# Altium schematic sheet Main.schdoc
size 508 x 338 mm
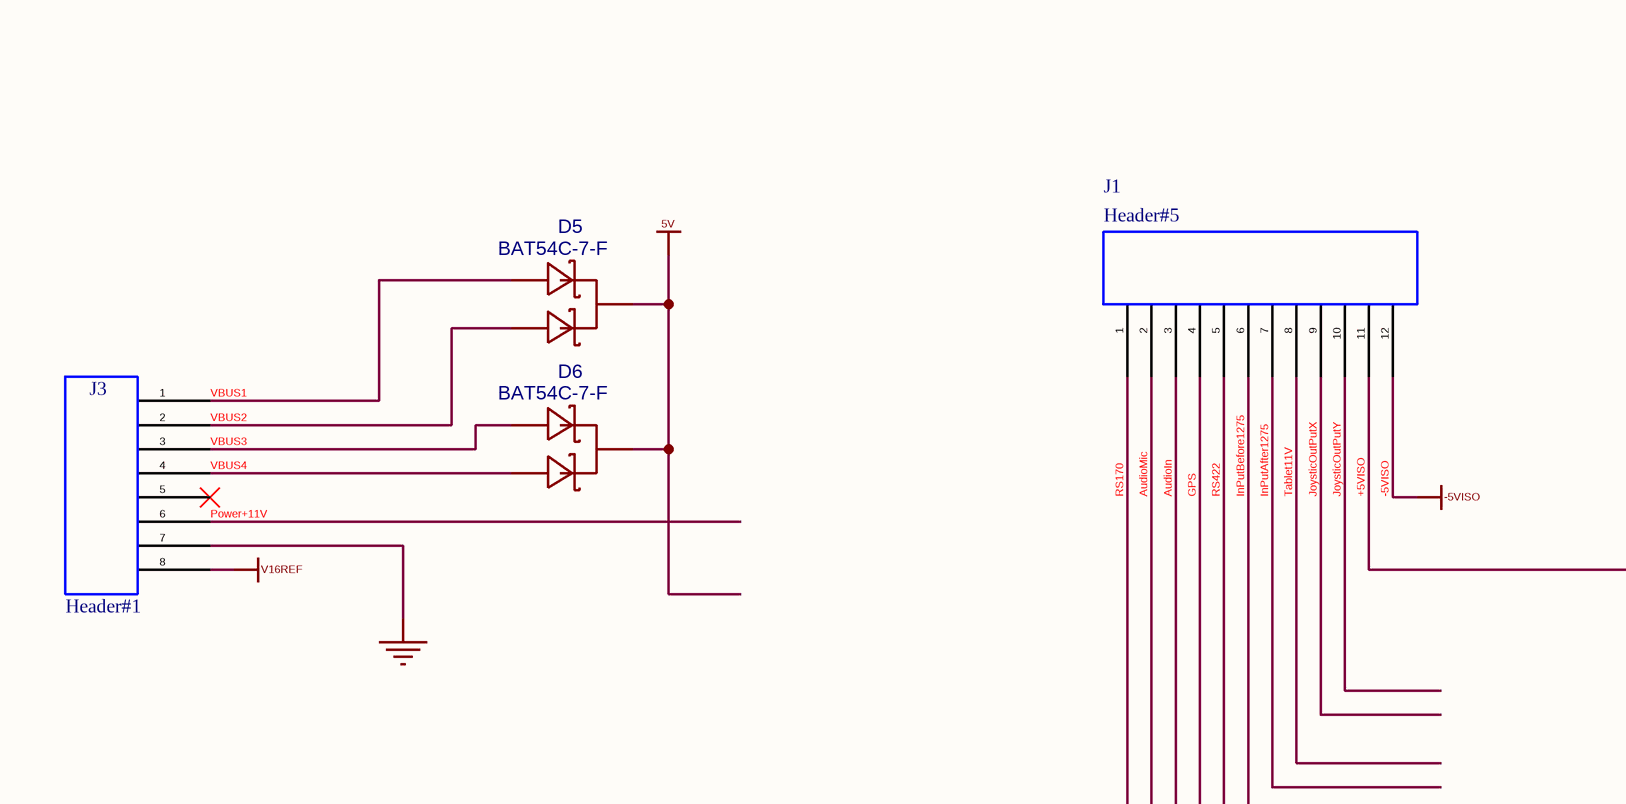
[diagram p0: Main.schdoc, top left]
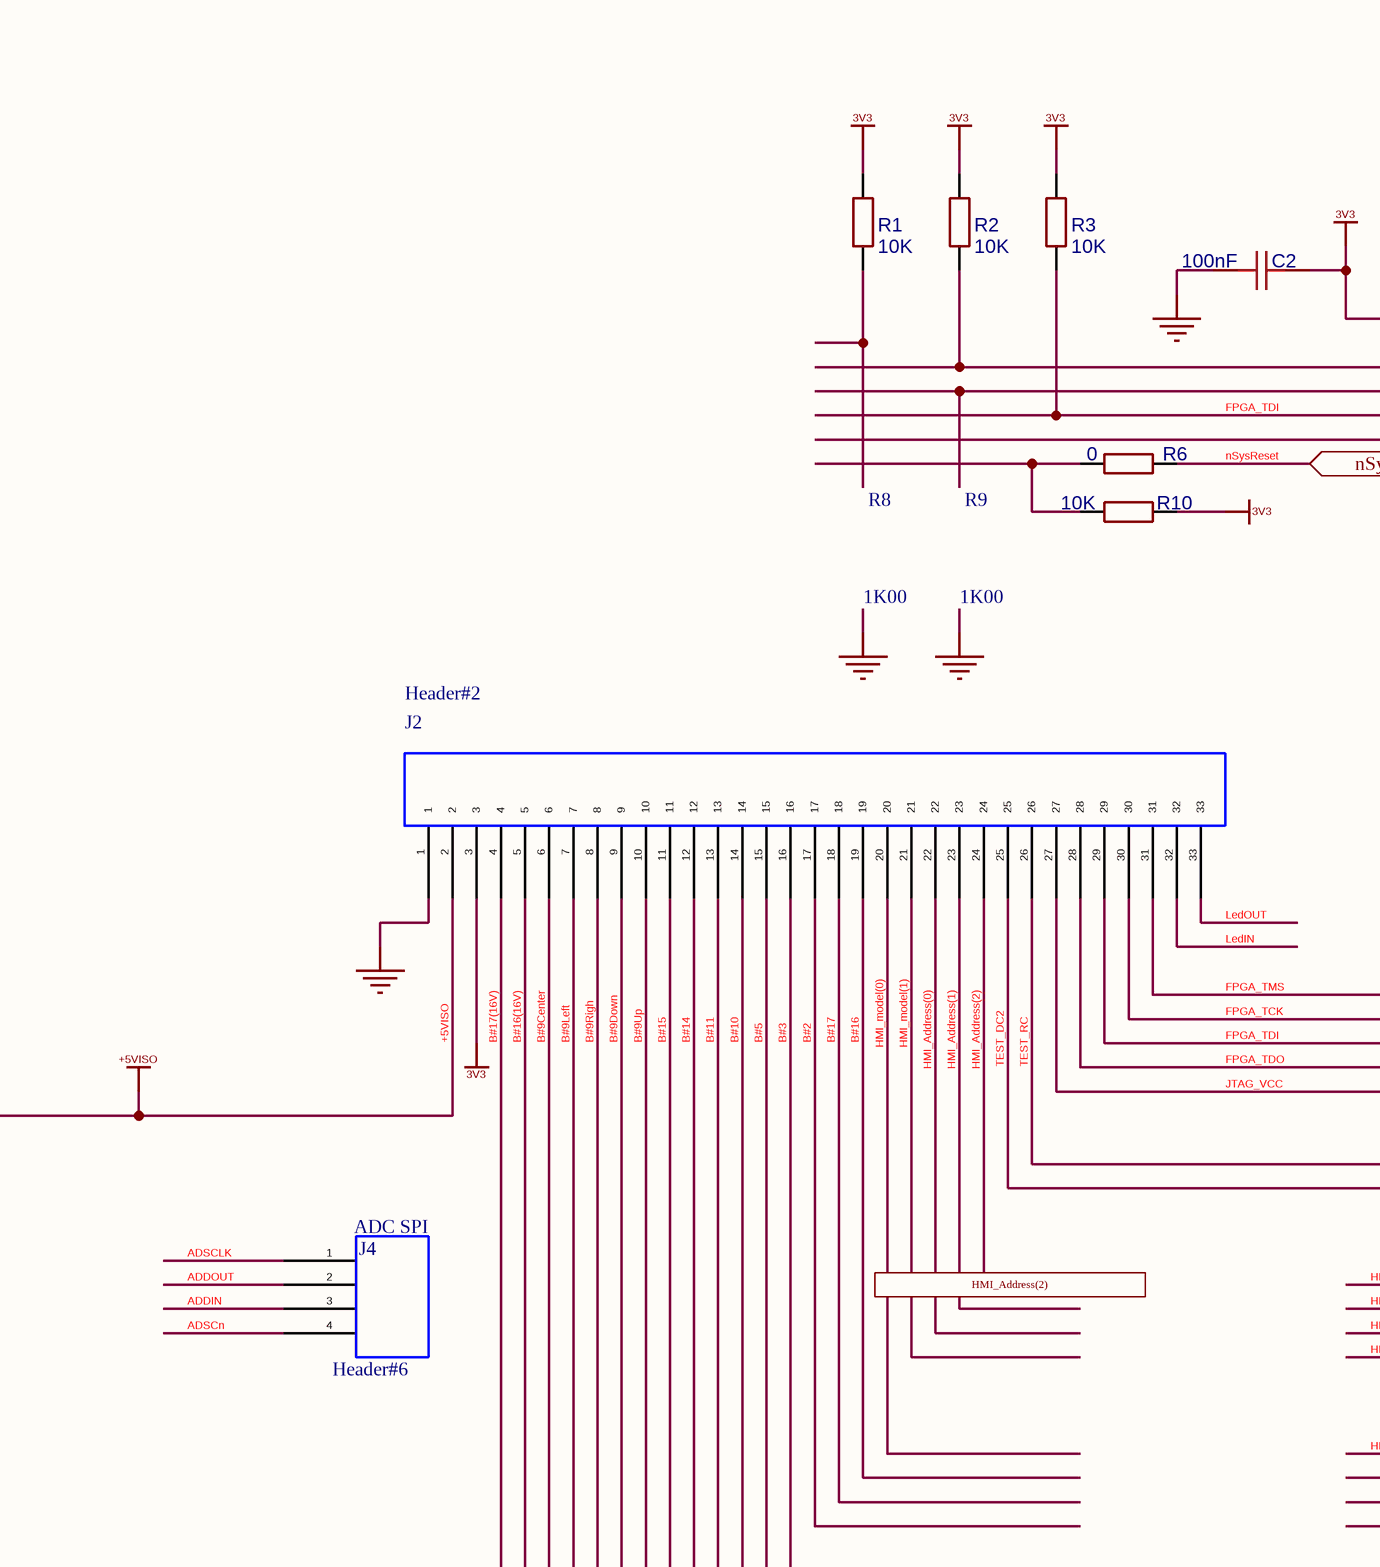
[diagram p1: Main.schdoc, top middle]
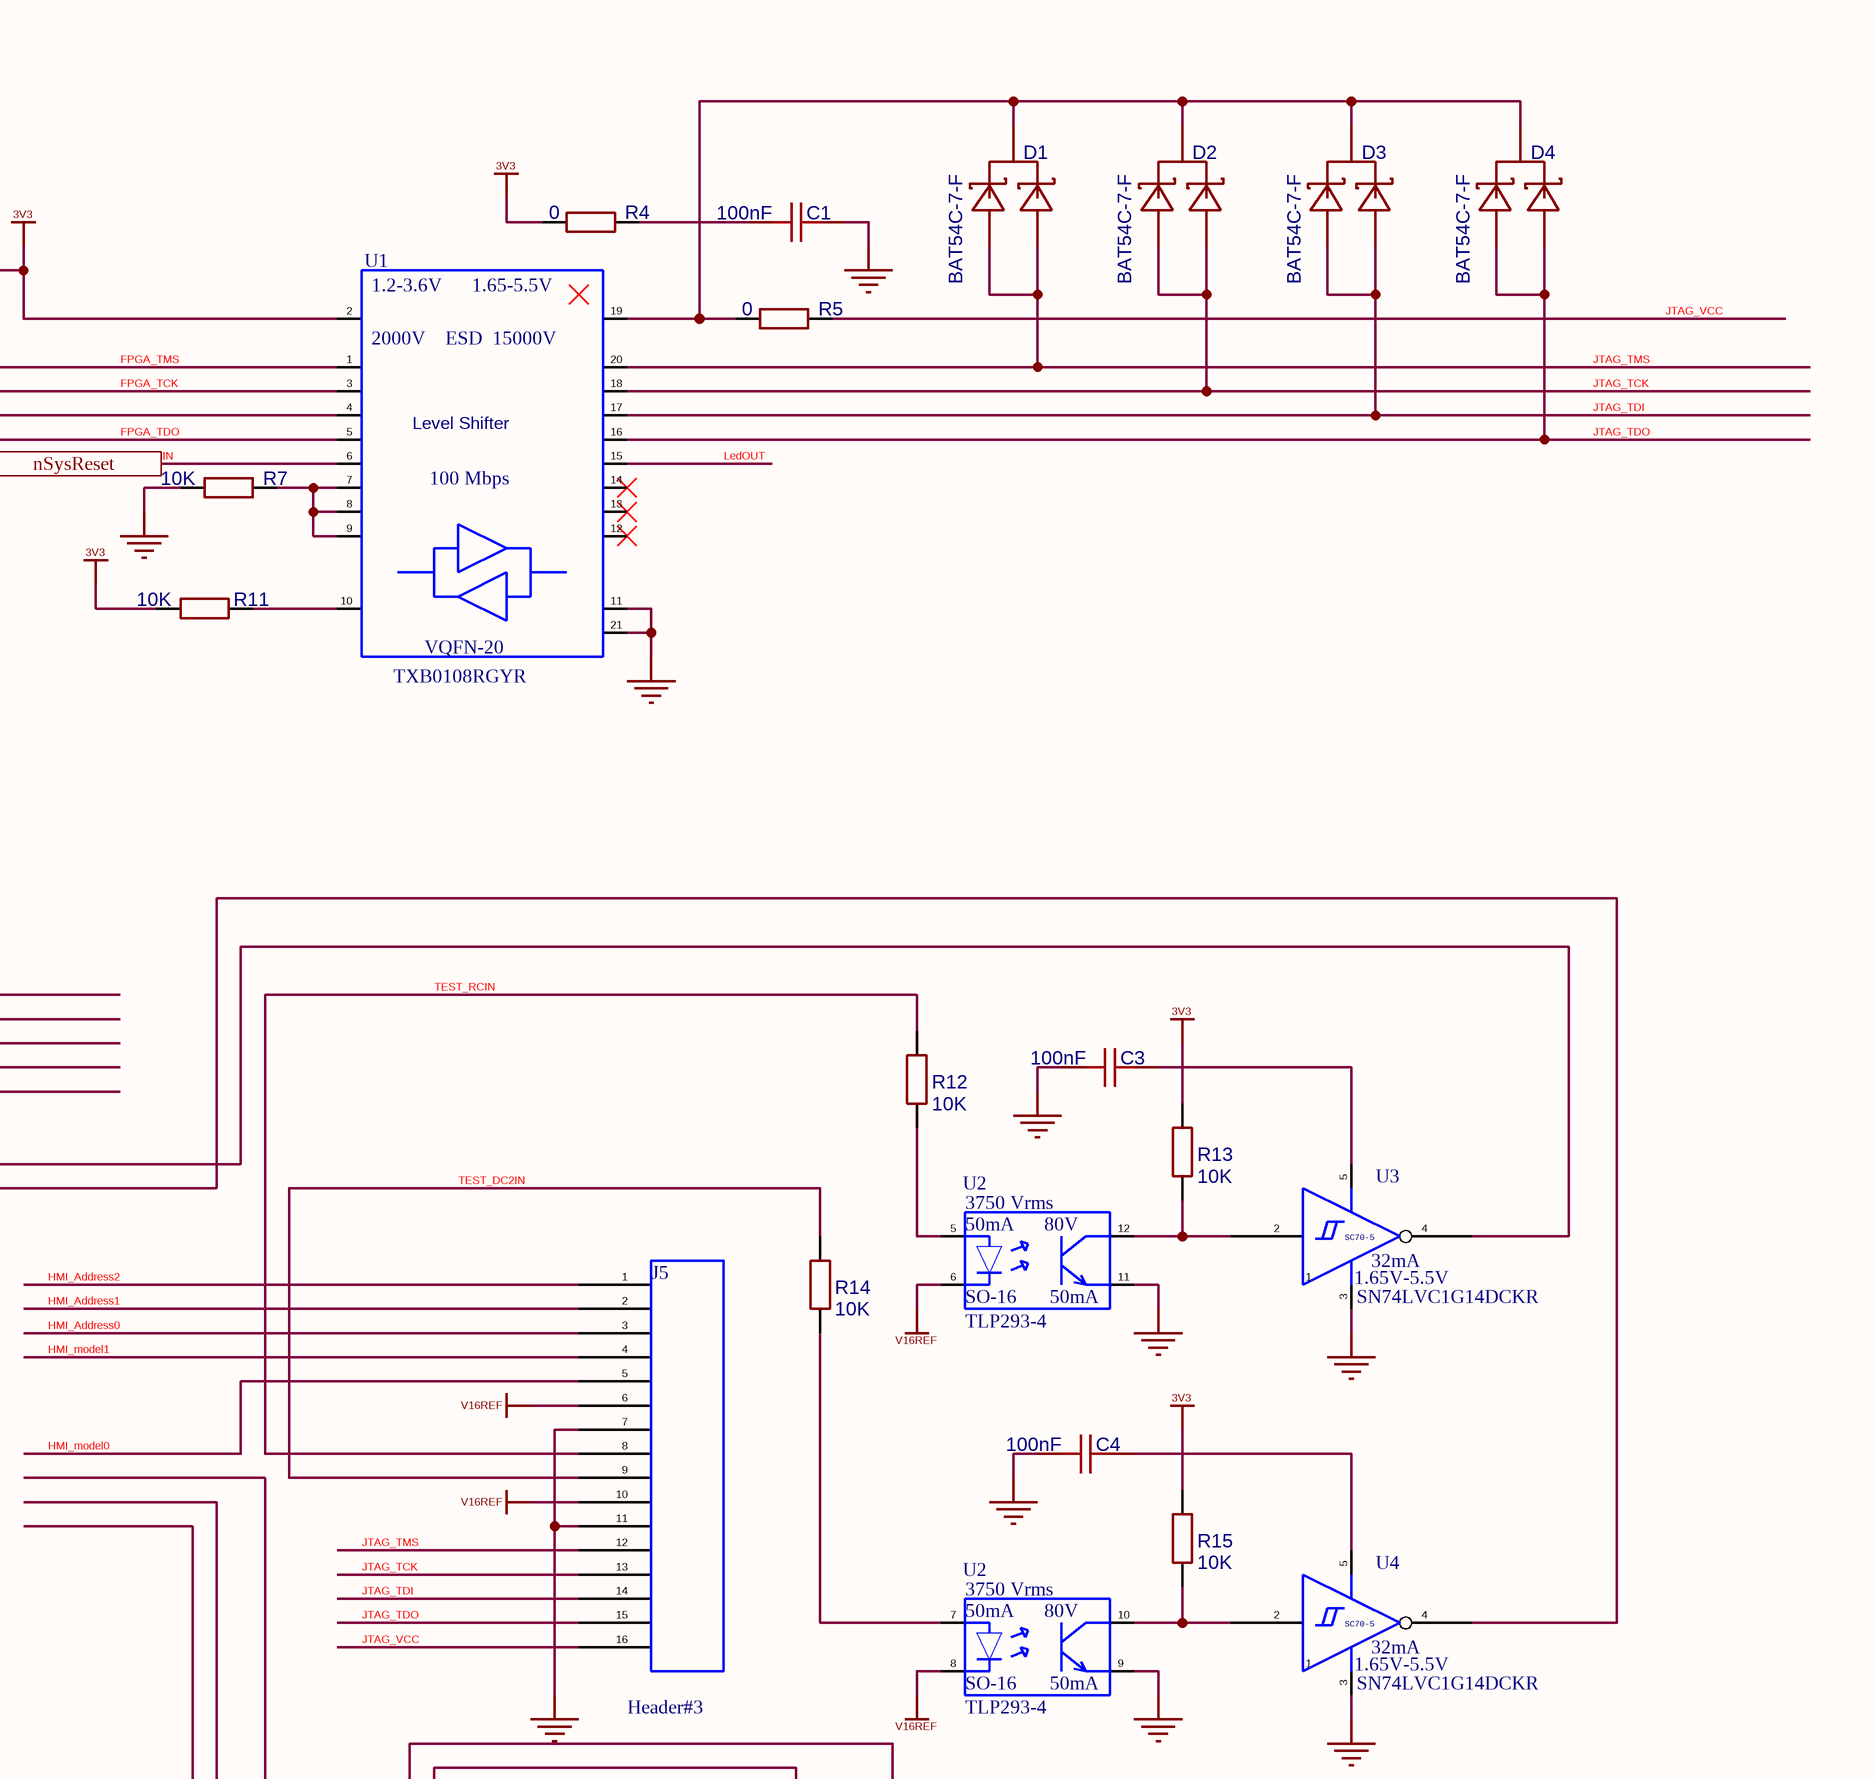
[diagram p2: Main.schdoc, top right]
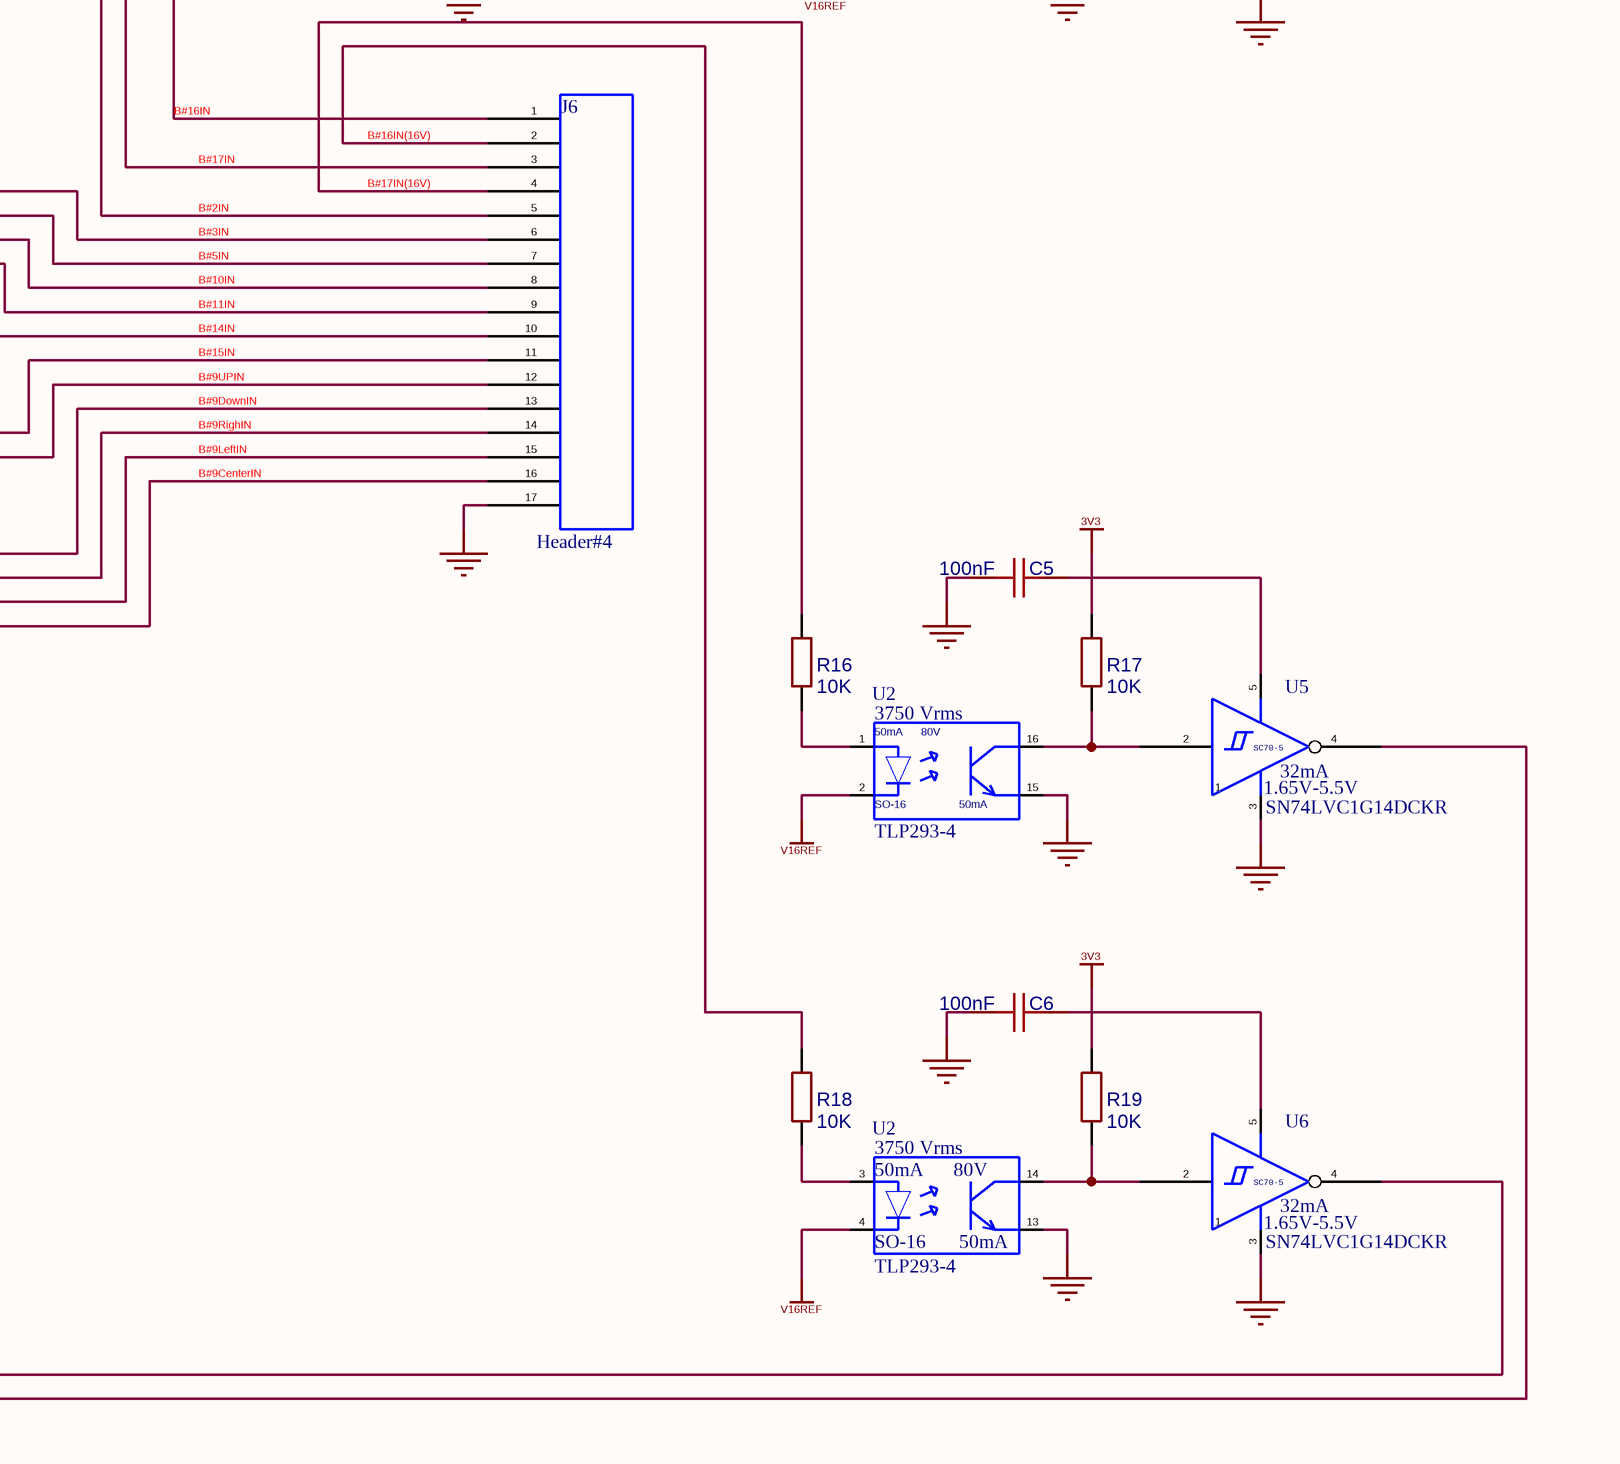
[diagram p3: Main.schdoc, bottom right]

## Parts
(Parts that share a designator on the sheet are numbered #1, #2 ... from top to bottom, then left to right.)
C1  100nF  [C0402]
C2  100nF  [C0402]
C3  100nF  [C0402]
C4  100nF  [C0402]
C5  100nF  [C0402]
C6  100nF  [C0402]
D1  BAT54C-7-F  [SOT-23-3_L2.9-W1.6-P1.90-LS2.8-BR]
D2  BAT54C-7-F  [SOT-23-3_L2.9-W1.6-P1.90-LS2.8-BR]
D3  BAT54C-7-F  [SOT-23-3_L2.9-W1.6-P1.90-LS2.8-BR]
D4  BAT54C-7-F  [SOT-23-3_L2.9-W1.6-P1.90-LS2.8-BR]
D5  BAT54C-7-F  [SOT-23-3_L2.9-W1.6-P1.90-LS2.8-BR]
D6  BAT54C-7-F  [SOT-23-3_L2.9-W1.6-P1.90-LS2.8-BR]
J1  Header#5  [39-28-1123]
J2  Header#2  [501190-3027]
J3  Header#1  [CONN-TH_7P-P2.50_B07B-XASK-1-A-LF-SN]
J4  Header#6  [B04B-XASK-1]
J5  Header#3  [501568-1507]
J6  Header#4  [501568-1507]
R1  10K  [R0402]
R2  10K  [R0402]
R3  10K  [R0402]
R4  0  [R0402]
R5  0  [R0402]
R6  0  [R0402]
R7  10K  [R0402]
R8  1K00  [0402]
R9  1K00  [0402]
R10  10K  [R0402]
R11  10K  [R0402]
R12  10K  [R0402]
R13  10K  [R0402]
R14  10K  [R0402]
R15  10K  [R0402]
R16  10K  [R0402]
R17  10K  [R0402]
R18  10K  [R0402]
R19  10K  [R0402]
U1  TXB0108RGYR  [VQFN-20_L4.5-W3.5-P0.50-BL-EP]
U2#1  TLP293-4  [SO-16_L10.3-W4.4-P1.27-LS7.0-BL]
U2#2  TLP293-4  [SO-16_L10.3-W4.4-P1.27-LS7.0-BL]
U2#3  TLP293-4  [SO-16_L10.3-W4.4-P1.27-LS7.0-BL]
U2#4  TLP293-4  [SO-16_L10.3-W4.4-P1.27-LS7.0-BL]
U3  SN74LVC1G14DCKR  [SC-70-5_L2.1-W1.3-P0.65-LS2.1-BR]
U4  SN74LVC1G14DCKR  [SC-70-5_L2.1-W1.3-P0.65-LS2.1-BR]
U5  SN74LVC1G14DCKR  [SC-70-5_L2.1-W1.3-P0.65-LS2.1-BR]
U6  SN74LVC1G14DCKR  [SC-70-5_L2.1-W1.3-P0.65-LS2.1-BR]

## Ports
HMI_Address(2) (in), nSysReset (in)

## Nets
3V3: C2.1 J2.3 R1.2 R2.1 R3.2 R4.1 R10.2 R11.2 R13.2 R15.2 R17.2 R19.2 U1.2(VCCA)
5V: D5.3(K) D6.3(K)
+5VISO: J1.11 J2.2
-5VISO: J1.12
GND: C1.1 C2.2 C3.2 C4.2 C5.2 C6.2 J2.1 J3.7 J5.7 J5.11 J6.17 R7.2 U1.11(GND) U1.21(EP) U2#1.11(E) U2#2.9(E) U2#3.15(E) U2#4.13(E) U3.3(GND) U4.3(GND) U5.3(GND) U6.3(GND)
V16REF: J3.8 J5.6 J5.10 U2#1.6(K) U2#2.8(K) U2#3.2(K) U2#4.4(K)
ADDIN: J4.3
ADDOUT: J4.2
ADSCLK: J4.1
ADSCn: J4.4
AudioIn: J1.3
AudioMic: J1.2
B#2: J2.17
B#2IN: J6.5
B#3: J2.16
B#3IN: J6.6
B#5: J2.15
B#5IN: J6.7
B#9Center: J2.6
B#9CenterIN: J6.16
B#9Down: J2.9
B#9DownIN: J6.13
B#9Left: J2.7
B#9LeftIN: J6.15
B#9Righ: J2.8
B#9RighIN: J6.14
B#9Up: J2.10
B#9UPIN: J6.12
B#10: J2.14
B#10IN: J6.8
B#11: J2.13
B#11IN: J6.9
B#14: J2.12
B#14IN: J6.10
B#15: J2.11
B#15IN: J6.11
B#16: J2.19
B#16(16V): J2.5 U6.4(O)
B#16IN: J6.1
B#16IN(16V): J6.2 R18.2
B#17: J2.18
B#17(16V): J2.4 U5.4(O)
B#17IN: J6.3
B#17IN(16V): J6.4 R16.2
FPGA_TCK: J2.30 U1.3(A2)
FPGA_TDI: J2.29 R3.1 U1.4(A3)
FPGA_TDO: J2.28 U1.5(A4)
FPGA_TMS: J2.31 R2.2 U1.1(A1)
GPS: J1.4
HMI_Address0: J5.3
HMI_Address1: J5.2
HMI_Address2: J5.1
HMI_Address(0): J2.22
HMI_Address(1): J2.23
HMI_Address(2): J2.24
HMI_model0: J5.5
HMI_model1: J5.4
HMI_model(0): J2.20
HMI_model(1): J2.21
InPutAfter1275: J1.7
InPutBefore1275: J1.6
JoysticOutPutX: J1.9
JoysticOutPutY: J1.10
JTAG_TCK: D2.1(A) D2.2(A) J5.13 U1.18(B2)
JTAG_TDI: D3.1(A) D3.2(A) J5.14 U1.17(B3)
JTAG_TDO: D4.1(A) D4.2(A) J5.15 U1.16(B4)
JTAG_TMS: D1.1(A) D1.2(A) J5.12 U1.20(B1)
JTAG_VCC: J2.27 J5.16 R5.2
LedIN: J2.32 R6.2 U1.6(A5) ; port nSysReset  [also labelled nSysReset]
LedOUT: J2.33 U1.15(B5)
Power+11V: J3.6
RS170: J1.1
RS422: J1.5
Tablet11V: J1.8
TEST_DC2: J2.25 U4.4(O)
TEST_DC2IN: J5.9 R14.2
TEST_RC: J2.26 U3.4(O)
TEST_RCIN: J5.8 R12.2
VBUS1: D5.1(A) J3.1
VBUS2: D5.2(A) J3.2
VBUS3: D6.1(A) J3.3
VBUS4: D6.2(A) J3.4
NetC1_2: C1.2 R4.2
NetC3_1: C3.1 U3.5(VCC)
NetC4_1: C4.1 U4.5(VCC)
NetC5_1: C5.1 U5.5(VCC)
NetC6_1: C6.1 U6.5(VCC)
NetD1_3: D1.3(K) D2.3(K) D3.3(K) D4.3(K) R5.1 U1.19(VCCB)
NetR6_1: R6.1 R10.1
NetR7_1: R7.1 U1.7(A6) U1.8(A7) U1.9(A8)
NetR11_1: R11.1 U1.10(OE)
NetR12_1: R12.1 U2#1.5(A)
NetR13_1: R13.1 U2#1.12(C) U3.2(I)
NetR14_1: R14.1 U2#2.7(A)
NetR15_1: R15.1 U2#2.10(C) U4.2(I)
NetR16_1: R16.1 U2#3.1(A)
NetR17_1: R17.1 U2#3.16(C) U5.2(I)
NetR18_1: R18.1 U2#4.3(A)
NetR19_1: R19.1 U2#4.14(C) U6.2(I)

Not connected (* = marked no-connect by the designer): J3 5*; R1 1; U1 12(B8)* 13(B7)* 14(B6)*; U3 1(NC); U4 1(NC); U5 1(NC); U6 1(NC)

## Notes on the sheet
- (in symbol SN74LVC1G14DCKR) SC70-5
- (in symbol TXB0108RGYR) Level Shifter

## Library data of the parts
C1-C6 = 100nF: BOM_Manufacturer: TDK; BOM_Manufacturer Part: C1005X7R1C104KT000F; nameAlias: Capacitance; Contributor: LCSC; BOM_Supplier: LCSC; BOM_Supplier Part: C338032; spicePre: C; spiceSymbolName: C1005X7R1C104KT000F
D1-D6 = BAT54C-7-F: BOM_Manufacturer: DIODES; Contributor: LCSC; BOM_Supplier: LCSC; BOM_Manufacturer Part: BAT54C-7-F; BOM_Supplier Part: C134405; BOM_JLCPCB Part Class: Extended Part; spicePre: D; spiceSymbolName: BAT54C-7-F
J1 = Header#5: Lumenis Part Number: CN-2005424; Power: 600V; Pitch: 4.2mm; PCB Footprint: Header#5
J2 = Header#2: Lumenis Part Number: CN-2006128; Power: 50V; Foot Print: 1.00mm; Current: 1 A; PCB Footprint: 501190-3027
J3 = Header#1: P/N: PO11108410; PCB Footprint: Header#1
J4 = Header#6: P/N: PO11108404; Label: ADC SPI; PCB Footprint: Header#6
J5 = Header#3: Lumenis Part Number: CN-2002538; PCB Footprint: Header#3
J6 = Header#4: Lumenis Part Number: CN-2002538; PCB Footprint: Header#4
R1-R3 R7 R10-R19 = 10K: BOM_Manufacturer: UniOhm; BOM_Manufacturer Part: 0402WGF1002TCE; nameAlias: Resistance (Ohms); BOM_Supplier: LCSC; BOM_Supplier Part: C25744; BOM_JLCPCB Part Class: Basic Part; spicePre: R; spiceSymbolName: 0402WGF1002TCE
R4-R6 = 0: BOM_Manufacturer: YAGEO; BOM_Manufacturer Part: RC0402JR-070RL; nameAlias: Resistance (Ohms); BOM_Supplier: LCSC; BOM_Supplier Part: C60485; BOM_JLCPCB Part Class: Extended Part; spicePre: R; spiceSymbolName: RC0402JR-070RL
R8 = 1K00: Part Number: RC0402FR-071KL; NO_XNET_CONNECTION: True; Tolerance: 1%; Power: 1/16W; OVPN: OVRS00022; MFG: Yageo; ASSY: NC; MOUNTING: SMT
R9 = 1K00: Part Number: RC0402FR-071KL; NO_XNET_CONNECTION: True; Tolerance: 1%; Power: 1/16W; OVPN: OVRS00022; MFG: Yageo; MOUNTING: SMT
U1 = TXB0108RGYR: Data rate: 100 Mbps; Voltage: 1.2-3.6V      1.65-5.5V; PcbFootprint: VQFN-20; OVPN: OVIC00147; MFG: Texas Instruments; ESD: 2000V    ESD  15000V; PCB Footprint: VQFN-20_TXB0108; PART NUMBER: TXB0108RGYR
U2#1-U2#4 = TLP293-4: PART NUMBER: TLP293-4(V4,E; Power: 50mA      80V; OVPN: OVIC00228; MFG: Toshiba Semiconductor and Storage; ISO: 3750 Vrms; Current Power: 50mA; PCB Footprint: SO-16_TLP293-4; FootPrint: SO-16
U3-U6 = SN74LVC1G14DCKR: VOLTAGE: 1.65V-5.5V; OVPN: OVIC00204; MFG: Texas Instruments; Current: 32mA; PCB Footprint: SC70-5_SN74LVC1G14DCKR; PART NUMBER: SN74LVC1G14DCKR